# Altium schematic sheet Audio.SchDoc
size B; SheetNumber: 7; SheetTotal: 9
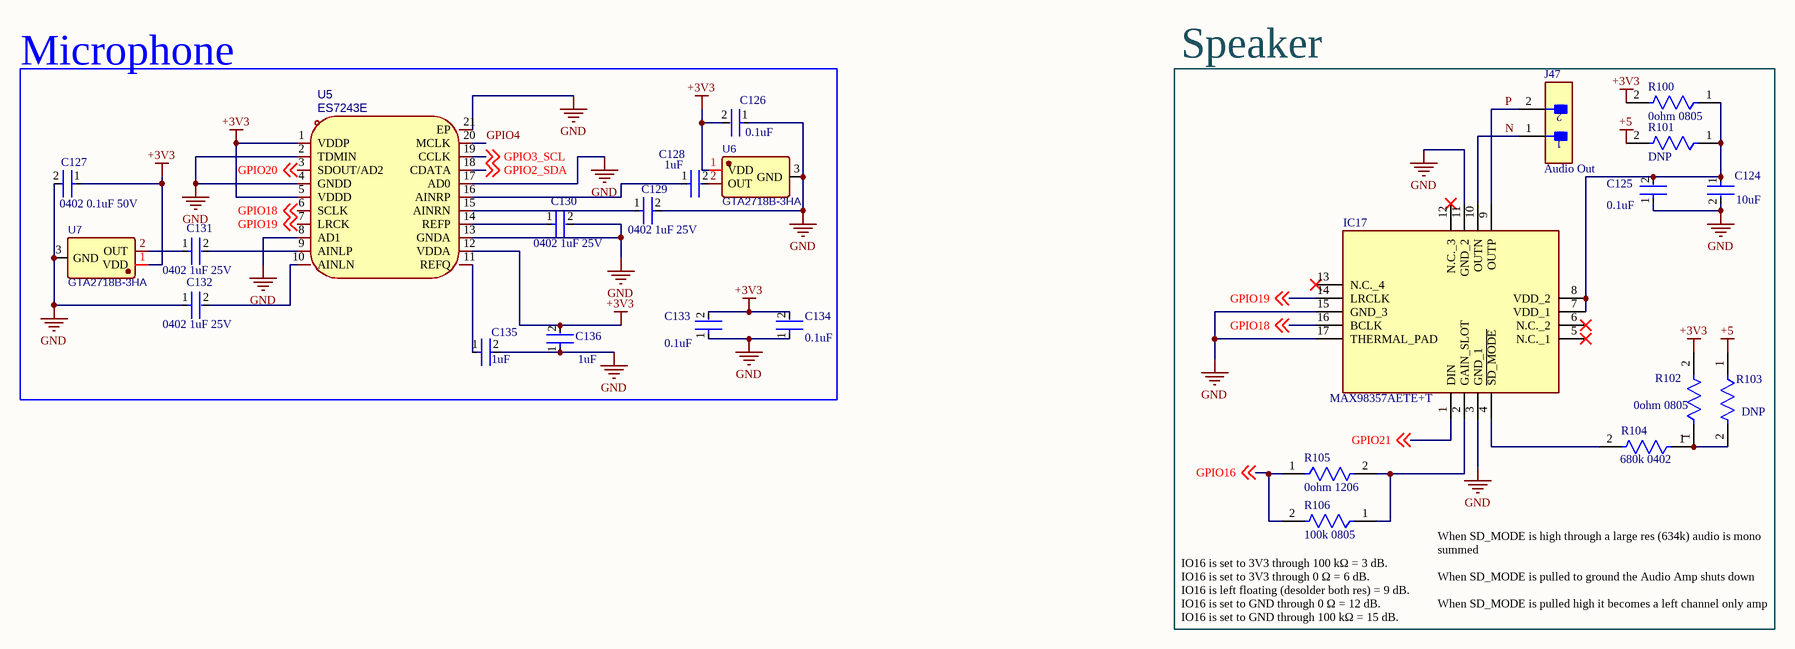
[diagram p0: Audio.SchDoc]

## Parts
C124  10uF  [FP-CC0603-DC-MFG]
C125  0.1uF  [FP-C0402-BB-MFG]
C126  0.1uF  [FP-C0402-BB-MFG]
C127  0402 0.1uF 50V  [FP-C0402-BB-MFG]
C128  1uF  [FP-C0402-BB-MFG]
C129  0402 1uF 25V  [FP-C0402-BB-MFG]
C130  0402 1uF 25V  [FP-C0402-BB-MFG]
C131  0402 1uF 25V  [FP-C0402-BB-MFG]
C132  0402 1uF 25V  [FP-C0402-BB-MFG]
C133  0.1uF  [FP-C0402-BB-MFG]
C134  0.1uF  [FP-C0402-BB-MFG]
C135  1uF  [FP-C0402-BB-MFG]
C136  1uF  [FP-C0402-BB-MFG]
IC17  MAX98357AETE+T  [QFN50P300X300X80-17N]
J47  Audio Out  [FP-TSW-102-07-F-S-MFG]
R100  0ohm 0805  [FP-RN73R2A-IPC_C]
R101  DNP  [FP-RN73R2A-IPC_C]
R102  0ohm 0805  [FP-RN73R2A-IPC_C]
R103  DNP  [FP-RN73R2A-IPC_C]
R104  680k 0402  [FP-AF0402-IPC_B]
R105  0ohm 1206  [FP-HCJ1206-MFG]
R106  100k 0805  [FP-RN73R2A-IPC_C]
U5  ES7243E  [QFN-20_L3.0-W3.0-P0.40-BL-EP1.7]
U6  GTA2718B-3HA  [MIC-SMD_3P-L2.8-W1.9_AP1688]
U7  GTA2718B-3HA  [MIC-SMD_3P-L2.8-W1.9_AP1688]

## Blocks framed on the sheet
Microphone: C126-C136 U5-U7
Speaker: C124 C125 IC17 J47 R100-R106

## Nets
+3V3: C126.2 C127.1 C133.2 C134.2 C136.2 R100.2 R102.2 U5.1(VDDP) U5.5(VDDD) U5.12(VDDA) U6.1(VDD) U7.1(VDD)
+5: R101.2 R103.1
GND: C124.2 C125.1 C126.1 C127.2 C129.2 C130.2 C132.1 C133.1 C134.1 C135.2 C136.1 IC17.3(GND_1) IC17.11(GND_2) IC17.15(GND_3) IC17.17(THERMAL_PAD) U5.2(TDMIN) U5.4(GNDD) U5.8(AD1) U5.13(GNDA) U5.17(AD0) U5.21(EP) U6.3(GND) U7.3(GND)
GPIO2_SDA: U5.18(CDATA) ; off-sheet GPIO2_SDA
GPIO3_SCL: U5.19(CCLK) ; off-sheet GPIO3_SCL
GPIO4: U5.20(MCLK)
GPIO16: R105.1 R106.2 ; off-sheet GPIO16
GPIO18: IC17.16(BCLK) U5.6(SCLK) ; off-sheet GPIO18
GPIO19: IC17.14(LRCLK) U5.7(LRCK) ; off-sheet GPIO19
GPIO20: U5.3(SDOUT/AD2) ; off-sheet GPIO20
GPIO21: IC17.1(DIN) ; off-sheet GPIO21
N: IC17.10(OUTN) J47.1
P: IC17.9(OUTP) J47.2
NetC124_1: C124.1 C125.2 IC17.7(VDD_1) IC17.8(VDD_2) R100.1 R101.1
NetC128_1: C128.1 U5.16(AINRP)
NetC128_2: C128.2 U6.2(OUT)
NetC129_1: C129.1 U5.15(AINRN)
NetC130_1: C130.1 U5.14(REFP)
NetC131_1: C131.1 U7.2(OUT)
NetC131_2: C131.2 U5.9(AINLP)
NetC132_2: C132.2 U5.10(AINLN)
NetC135_1: C135.1 U5.11(REFQ)
NetIC17_2: IC17.2(GAIN_SLOT) R105.2 R106.1
NetIC17_4: IC17.4(~{SD_MODE}) R104.2
NetR102_1: R102.1 R103.2 R104.1

Not connected (* = marked no-connect by the designer): IC17 5(N.C._1)* 6(N.C._2)* 12(N.C._3)* 13(N.C._4)*

## Notes on the sheet
- (near R106) IO16 is set to 3V3 through 100 kΩ = 3 dB.
  IO16 is set to 3V3 through 0 Ω = 6 dB.
  IO16 is left floating (desolder both res) = 9 dB.
  IO16 is set to GND through 0 Ω = 12 dB.
  IO16 is set to GND through 100 kΩ = 15 dB.
- When SD_MODE is high through a large res (634k) audio is mono summed
  When SD_MODE is pulled to ground the Audio Amp shuts down
  When SD_MODE is pulled high it becomes a left channel only amp

## Library data of the parts
C124 = CMP-00621-81932632-1: C96446; Capacitance: 10µF; Voltage Rating: 16V; Dielectric: X5R; Material: Ceramic; Tolerance: 10%; NexarPartId: 81932632; Height: 1mm; Halogen Free: Halogen Free; Max Operating Temperature: 85°C; Voltage Rating (DC): 16V; Lead Free: Lead Free; RoHS: Non-Compliant; Min Operating Temperature: -55°C; Case/Package: 0603
C125-C127 C133 C134 = CMP-03020-014070-2: C307331; Manufacturer: Kemet; Manufacturer Part Number: C0402C104M3PAC7867; Material: Ceramic; Tolerance: 0.2; Temperature Characteristic: X5R; Value: 0.10 μF; Temperature Coefficient: 15%; Voltage Rating: 25 V; Height: 0.55mm; Category: Cap; Temperature: -55°C to +125°C; Automotive: No; Package: C0402-BB; Temperature Range Low: -55°C; ComponentLink2Description: Datasheet; Device Class L3: Ceramic Capacitors; ComponentLink2URL: https://content.kemet.com/datasheets/KEM_C1002_X7R_SMD.pdf; Octopart: https://octopart.com/c0402c104m3pac7867-kemet-84304880; RoHS: TRUE; Temperature Range High: +125°C; Device Class L1: Passive Components; Capacitance: 0.10 μF; Lead Free: Yes; Ipc Land Pattern Name: CAPC10050X50; Device Class L2: Capacitors; Digikey Description: CAP CER 0.1UF 25V X5R 0402
C128 C135 C136 = CMP-03020-014070-2: C52923; Manufacturer: Kemet; Manufacturer Part Number: C0402C104M3PAC7867; Material: Ceramic; Tolerance: 0.2; Temperature Characteristic: X5R; Value: 0.10 μF; Temperature Coefficient: 15%; Voltage Rating: 25 V; Height: 0.55mm; Category: Cap; Temperature: -55°C to +125°C; Automotive: No; Package: C0402-BB; Temperature Range Low: -55°C; ComponentLink2Description: Datasheet; Device Class L3: Ceramic Capacitors; ComponentLink2URL: https://content.kemet.com/datasheets/KEM_C1002_X7R_SMD.pdf; Octopart: https://octopart.com/c0402c104m3pac7867-kemet-84304880; RoHS: TRUE; Temperature Range High: +125°C; Device Class L1: Passive Components; Capacitance: 0.10 μF; Lead Free: Yes; Ipc Land Pattern Name: CAPC10050X50; Device Class L2: Capacitors; Digikey Description: CAP CER 0.1UF 25V X5R 0402
C129-C132 = CMP-03020-014070-2: C52923; Manufacturer: Kemet; Manufacturer Part Number: C0402C104M3PAC7867; Material: Ceramic; Tolerance: 0.2; Temperature Characteristic: X5R; Value: 0.10 μF; Temperature Coefficient: 15%; Height: 0.55mm; Category: Cap; Temperature: -55°C to +125°C; Automotive: No; Package: C0402-BB; Temperature Range Low: -55°C; ComponentLink2Description: Datasheet; Device Class L3: Ceramic Capacitors; ComponentLink2URL: https://content.kemet.com/datasheets/KEM_C1002_X7R_SMD.pdf; Octopart: https://octopart.com/c0402c104m3pac7867-kemet-84304880; RoHS: TRUE; Temperature Range High: +125°C; Device Class L1: Passive Components; Capacitance: 0.10 μF; Lead Free: Yes; Voltage Rating: 25 V; Ipc Land Pattern Name: CAPC10050X50; Device Class L2: Capacitors; Digikey Description: CAP CER 0.1UF 25V X5R 0402
IC17 = MAX98357AETE+T: C910544; Manufacturer_Name: Analog Devices; Datasheet Link: https://datasheets.maximintegrated.com/en/ds/MAX98357A-MAX98357B.pdf; Height: 0.8mm; Manufacturer_Part_Number: MAX98357AETE+T; Mouser Part Number: 700-MAX98357AETE+T; Mouser Price/Stock: https://www.mouser.co.uk/ProductDetail/Analog-Devices-Maxim-Integrated/MAX98357AETE%2bT?qs=AAveGqk956HhNpoJjF5x2g%3D%3D; Arrow Part Number: MAX98357AETE+T; Arrow Price/Stock: https://www.arrow.com/en/products/max98357aetet/analog-devices?utm_currency=USD&region=nac
J47 = CMP-02766-001458-1: CONN HEADER VERT 2POS 2.54MM; Gender: Male; Max Current Rating: 7.6A; Number of Contacts: 2; Max Voltage Rating (AC): 550V; Orientation: Straight; Depth: 2.54mm; Series: TSW; Package Quantity: 1; Min Operating Temperature: -55°C; Max Operating Temperature: 125°C; Contact Type: Male Pin; Contact Shape: Square; Color: Black; Housing Color: Black; Connector Type: Header; Fastening Type: Pull; Radiation Hardening: No; Pitch: 2.54mm; Housing Material: Polyester; Mount: Through Hole; Number of Positions: 2; Number of Rows: 1; Contact Material: Bronze; Insulation Color: Black; Contact Finish - Mating: GOLD; Termination: Solder; Insulation Material: PBT; Length: 5.08mm; Flammability Rating: UL94 V-0; Contact Mating Length: 0.23inch; REACH SVHC: No SVHC; Contact Plating: Gold; RoHS Compliant: Yes; Packaging: Bulk
R100 R102 = CMP-04015-014497-1: C17477
R101 R103 = CMP-04015-014497-1: DNP 0805
R104 = CMP-03412-049911-1: C54920820; Resistance: 4.3kR; Max Power Dissipation: 63mW; Temperature Coefficient: 100ppm/°C; Tolerance: 5%; Case/Package: 0402; Height: 0.015inch; Width: 0.02inch; Min Operating Temperature: -55°C; Packaging: Tape and Reel; Max Operating Temperature: 155°C; Features: Moisture Resistant; Series: AF; Number of Terminations: 2; Length: 0.039inch; Resistor Type: Thick Film; RoHS Compliant: Yes; LCSC: C54920820
R105 = CMP-26527-002752-1: C17888; Resistance: 0mR; Radiation Hardening: No; Features: Automotive AEC-Q200; RoHS Compliant: Yes; Height: 0.026inch; Case Code (Metric): 3216; Min Operating Temperature: -55°C; Number of Terminations: 2; Mount: Surface Mount; Case/Package: 1206; Termination: Wraparound; Length: 0.122inch; Packaging: Tape and Reel; Max Operating Temperature: 155°C; Case Code (Imperial): 1206; Package Quantity: 5000; Width: 0.061inch
R106 = CMP-04015-014497-1: C149504
U5 = ES7243E: C2929446; Manufacturer: Everest-semi(顺芯); Add into BOM: yes; Resolution: 24; Number of Channels: 16; Voltage - Supply: 1.7V~3.6V; Interface Type: I2S; Chip Type Parameters/Description: Stereo Audio ADC; Symbol: ES7243E; Device: ES7243E; LCSC Part Name: ES7243E; Supplier Part: C2929446; Manufacturer Part: ES7243E; Supplier Footprint: QFN-20; JLCPCB Part Class: Extended Part; Datasheet: https://item.szlcsc.com/datasheet/ES7243E/3264523.html; Supplier: LCSC; Convert to PCB: yes; Operating Temperature: -40℃~+85℃
U6 U7 = GTA2718B-3HA: C50275773; Manufacturer: Gettop(共达); Contributor: lcsc; Supplier: LCSC; Supplier Part: C50275773; Manufacturer Part: GTA2718B-3HA; JLCPCB Part Class: Extended Part; spicePre: U; spiceSymbolName: GTA2718B-3HA